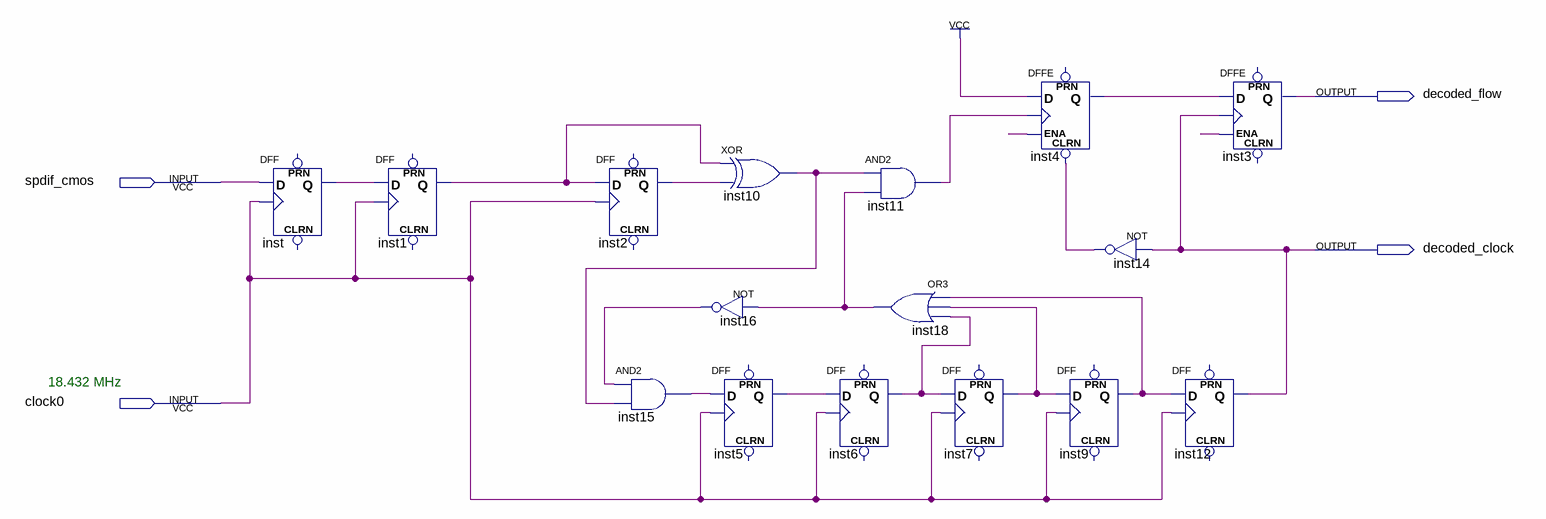
[diagram p0: schematic sheet]
// Quartus schematic equalizer.bdf as structural Verilog: 16 symbols, 4 pins
module equalizer (
  input  spdif_cmos,
  input  clock0,
  output decoded_flow,
  output decoded_clock
);

  wire inst1_q, inst2_q, inst4_q, inst5_q, inst6_q, inst7_q, inst9_q, inst10_out, inst11_out, inst14_out,
       inst15_out, inst16_out, inst18_out, inst_q, undriven, undriven_2;

  DFF inst (.CLK(clock0), .D(spdif_cmos), .Q(inst_q));  // open: CLRN, PRN
  DFF inst1 (.CLK(clock0), .D(inst_q), .Q(inst1_q));  // open: CLRN, PRN
  DFF inst2 (.CLK(clock0), .D(inst1_q), .Q(inst2_q));  // open: CLRN, PRN
  and inst15 (inst15_out, inst16_out, inst10_out);
  xor inst10 (inst10_out, inst1_q, inst2_q);
  not inst16 (inst16_out, inst18_out);
  DFF inst5 (.CLK(clock0), .D(inst15_out), .Q(inst5_q));  // open: CLRN, PRN
  and inst11 (inst11_out, inst10_out, inst18_out);
  or inst18 (inst18_out, inst9_q, inst7_q, inst6_q);
  DFF inst6 (.CLK(clock0), .D(inst5_q), .Q(inst6_q));  // open: CLRN, PRN
  DFF inst7 (.CLK(clock0), .D(inst6_q), .Q(inst7_q));  // open: CLRN, PRN
  DFFE inst4 (.CLRN(inst14_out), .D(1'b1), .CLK(inst11_out), .ENA(undriven), .Q(inst4_q));  // open: PRN
  not inst14 (inst14_out, decoded_clock);
  DFF inst9 (.CLK(clock0), .D(inst7_q), .Q(inst9_q));  // open: CLRN, PRN
  DFF inst12 (.CLK(clock0), .D(inst9_q), .Q(decoded_clock));  // open: CLRN, PRN
  DFFE inst3 (.D(inst4_q), .CLK(decoded_clock), .ENA(undriven_2), .Q(decoded_flow));  // open: PRN, CLRN

  // Notes on the sheet:
  //   18.432 MHz
endmodule
